# EasyEDA Pro project ProPrj_transverter-front-end_2026-04-14.epro, schematic transverter-power-board
Board Name: transverter-power-board; Create Date: 2026-04-02; Page Name: power-board; Project Name: transverter-front-end; Schematic Name: transverter-power-board; Update Date: 2026-04-13; Add into BOM: yes; Company: Your Company; Convert to PCB: yes; Date: 2026-02-19; Draw By: dbenhart; REV: 1.0; Sheet: 1/1; spicePre: .
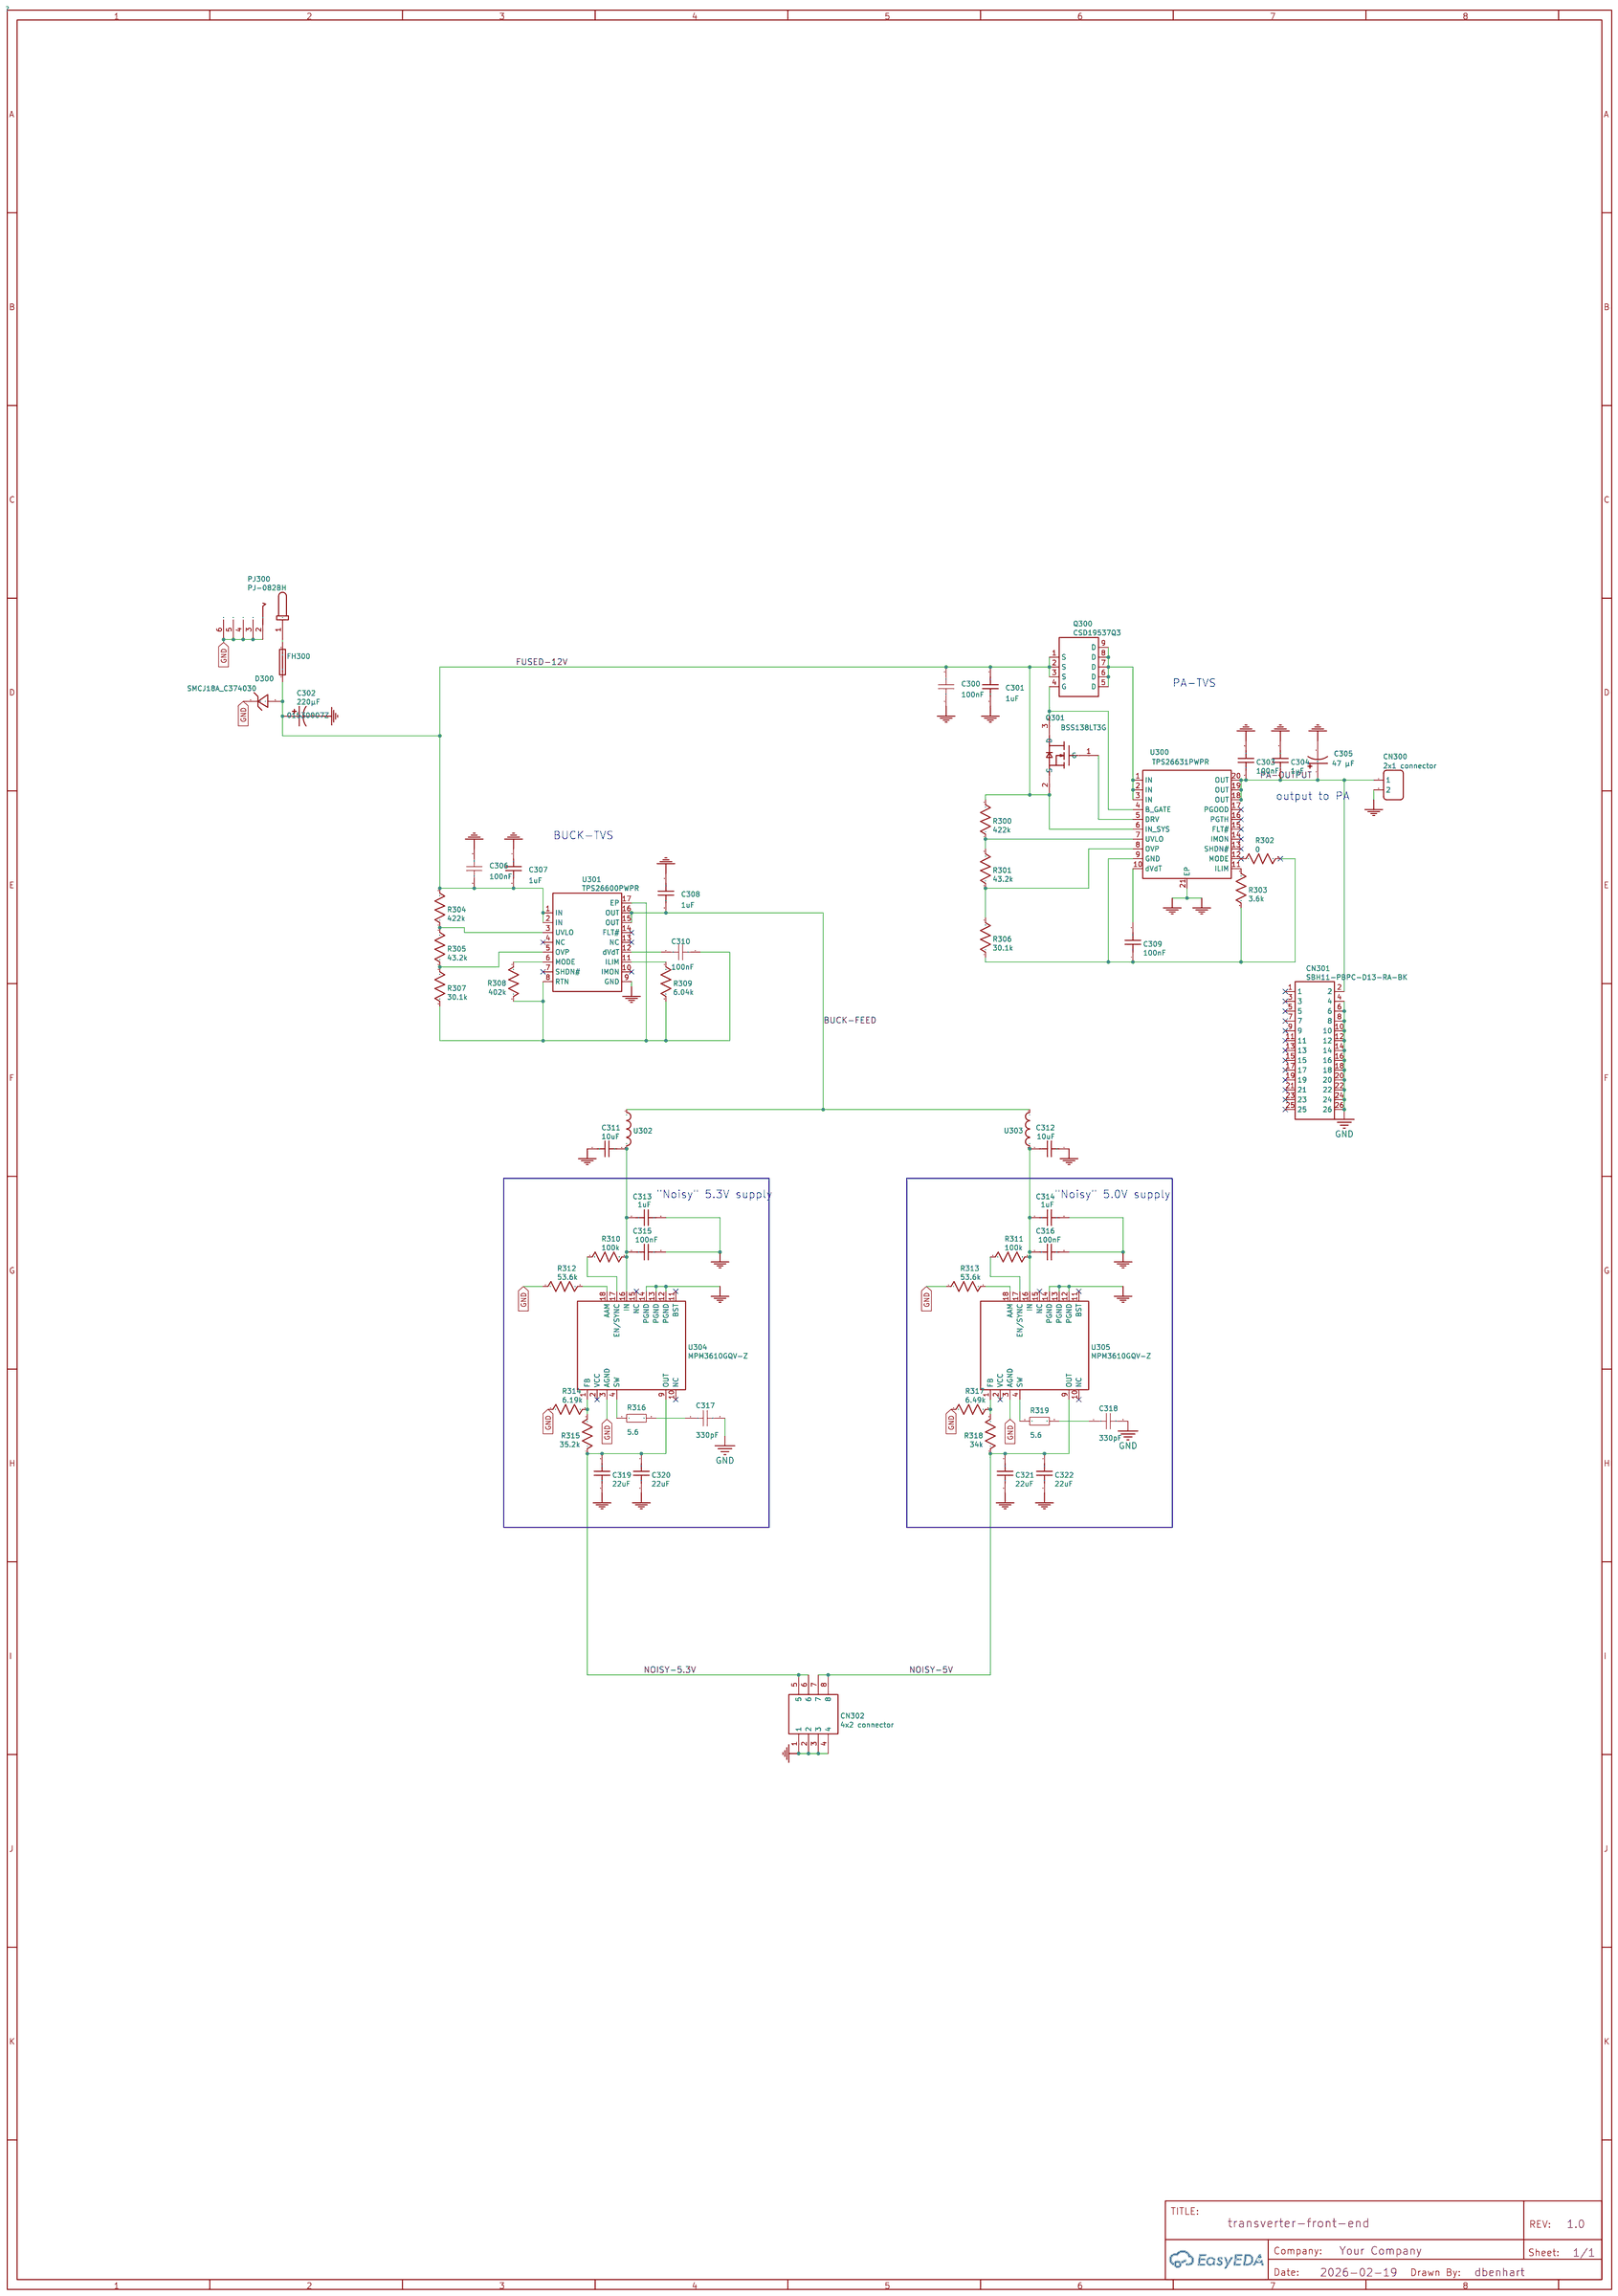
[diagram p4: schematic sheet]

## Parts
C300  100nF  [C0805]
C301  1uF  [C0805]
C302  220µF  [CAP-TH_BD10.0-P5.00-D0.6-FD]
C303  100nF  [C0805]
C304  1uF  [C0805]
C305  47 µF  [CAP-TH_BD8.0-P3.50-D0.6-FD]
C306  100nF  [C0805]
C307  1uF  [C0805]
C308  1uF  [C0805]
C309  100nF  [C0805]
C310  100nF  [C0805]
C311  10uF  [C0805]
C312  10uF  [C0805]
C313  1uF  [C0805]
C314  1uF  [C0805]
C315  100nF  [C0805]
C316  100nF  [C0805]
C317  330pF  [C0805]
C318  330pF  [C0805]
C319  22uF  [C0805]
C320  22uF  [C0805]
C321  22uF  [C0805]
C322  22uF  [C0805]
CN300  2x1 connector  [CONN-TH_2P-P3.00_MOLEX_436500200]
CN301  SBH11-PBPC-D13-RA-BK  [IDC-TH_26P-P2.54-H-M-R2-C13-W8.8]
CN302  4x2 connector  [CONN-TH_0430450800]
D300  SMCJ18A_C374030  [SMC_L6.9-W5.9-LS7.9-RD]
FH300  01530007Z  [01530007Z]
PJ300  PJ-082BH  [AUDIO-TH_PJ-082BH]
Q300  CSD19537Q3  [DFN-8_L3.3-W3.3-P0.65-BL-3]
Q301  BSS138LT3G  [SOT-23-3_L2.9-W1.3-P1.90-LS2.4-BR]
R300  422k  [R0805]
R301  43.2k  [R0805]
R302  0  [R0805]
R303  3.6k  [R0805]
R304  422k  [R0805]
R305  43.2k  [R0805]
R306  30.1k  [R0805]
R307  30.1k  [R0805]
R308  402k  [R0805]
R309  6.04k  [R0805]
R310  100k  [R0805]
R311  100k  [R0805]
R312  53.6k  [R0805]
R313  53.6k  [R0805]
R314  6.19k  [R0805]
R315  35.2k  [R0805]
R316  5.6  [R0805]
R317  6.49k  [R0805]
R318  34k  [R0805]
R319  5.6  [R0805]
U300  TPS26631PWPR  [HTSSOP-20_L6.5-W4.4-P0.65-LS6.4-BL-EP]
U301  TPS26600PWPR  [HTSSOP-16_L5.0-W4.4-P0.65-LS6.4-BL-EP2.5]
U302  BLM31PG601SH1L  [L1206]
U303  BLM31PG601SH1L  [L1206]
U304  MPM3610GQV-Z  [QFN-20_L5.0-W3.0-TL-MPM3610GQV-Z]
U305  MPM3610GQV-Z  [QFN-20_L5.0-W3.0-TL-MPM3610GQV-Z]

## Library data of the parts
C300 C306 C310 = KGM21NR71E104KT: Capacitance:100nF Tolerance:±10% Tolerance:±10% Voltage Rating:25V Temperature Coefficient:X7R; LCSC Part Name: 100nF ±10% 25V; Supplier Part: C20220997; Manufacturer: Kyocera AVX; JLCPCB Part Class: Extended Part; Supplier: LCSC; Tolerance: ±10%; Voltage Rating: 25V; Temperature Coefficient: X7R
C301 C307 C308 C313 C314 = 1uF: Supplier Part: 478-KGM21ER71E105KUCT-ND; Supplier: Digi-Key; Manufacturer Part: KGM21ER71E105KU; voltage: 25; Manufacturer: KYOCERA AVX; nameAlias: Value(F); Contributor: LCEDA_Lib; spicePre: C; spiceSymbolName: C_0603_US; Package Display: No
C302 = EEH-AZS1H221B: Supplier: LCSC; Supplier Part: C7271692; Manufacturer: PANASONIC(松下); JLCPCB Part Class: Extended Part; Contributor: lcsc; spicePre: U; spiceSymbolName: EEH-AZSE102UB
C303 C309 = 100nF: Supplier Part: C2182247; Supplier: Digi-Key; Manufacturer Part: KGM21NR71E104KT; voltage: 50; Manufacturer: KYOCERA AVX; JLCPCB Part Class: Extended Part; nameAlias: Value(F); Contributor: LCEDA_Lib; spicePre: C; spiceSymbolName: C_0603_US; Package Display: No
C304 = 1uF: Supplier Part: 478-KGM21ER71E105KUCT-ND; Supplier: Digi-Key; Manufacturer Part: KGM21ER71E105KU; voltage: 25; Manufacturer: KYOCERA AVX; JLCPCB Part Class: Extended Part; nameAlias: Value(F); Contributor: LCEDA_Lib; spicePre: C; spiceSymbolName: C_0603_US; Package Display: No
C305 = EEH-AZA1H470B: Supplier: Digi-Key; Supplier Part: 10-EEH-AZA1H470BCT-ND; Manufacturer: PANASONIC(松下); JLCPCB Part Class: Extended Part; Contributor: lcsc; spicePre: C; spiceSymbolName: EEH-AZA1H680B
C311 C312 = 10uF: Supplier Part: 490-GRM21BZ71E106KE15LCT-ND; Supplier: Digi-Key; Manufacturer Part: GRM21BZ71E106KE15L; voltage: 25; Manufacturer: Murata; nameAlias: Value(F); Contributor: LCEDA_Lib; spicePre: C; spiceSymbolName: C_0603_US; Package Display: No
C315 C316 = 100nF: Supplier Part: 478-KGM21NR71E104KTCT-ND; Supplier: Digi-Key; Manufacturer Part: KGM21NR71E104KT; voltage: 50; Manufacturer: KYOCERA AVX; nameAlias: Value(F); Contributor: LCEDA_Lib; spicePre: C; spiceSymbolName: C_0603_US; Package Display: No
C317 = CAP_0603: Supplier Footprint: 0805; Manufacturer: KYOCERA AVX; Manufacturer Part: KGM21BCG1H331JT; Capacitance: 330pf
C318 = CAP_0603: Supplier Footprint: 0805; Manufacturer: KYOCERA AVX; Manufacturer Part: KGM21BCG1H331JT
C319-C322 = 22uF: Supplier: LCSC; Supplier Part: C907991; Manufacturer: muRata(村田); Manufacturer Part: GRM21BZ71A226ME15L; JLCPCB Part Class: Extended Part; nameAlias: Value; Contributor: lcsc; spicePre: C; spiceSymbolName: GRM21BZ71A226ME15L
CN300 = MOLEX 2PIN: Manufacturer: MOLEX; Manufacturer Part: 436500200; Supplier: LCSC; Supplier Part: C192562; Contributor: Jayden Lee; spicePre: J
CN301 = SBH11-PBPC-D13-RA-BK: Supplier: LCSC; Supplier Part: C17260960; Manufacturer: Sullins; JLCPCB Part Class: Extended Part; Contributor: lcsc; spicePre: C
CN302 = 0430450800: Supplier: LCSC; Manufacturer: MOLEX; Supplier Part: C122422; JLCPCB Part Class: Extended Part; spicePre: C
D300 = SMCJ18A_C374030: Supplier: LCSC; Supplier Part: C374030; Manufacturer: Littelfuse(美国力特); Manufacturer Part: SMCJ18A; JLCPCB Part Class: Extended Part; Contributor: LCSC; spicePre: D
FH300 = 01530007Z: Supplier: LCSC; Supplier Part: C206906; Manufacturer: Littelfuse(美国力特); JLCPCB Part Class: Extended Part; Contributor: LCSC; spicePre: F
PJ300 = PJ-082BH: Supplier: LCSC; Supplier Part: C3094233; Manufacturer: CUI; JLCPCB Part Class: Extended Part; Contributor: lcsc; spicePre: P
Q300 = CSD19537Q3: Supplier: LCSC; Supplier Part: C478469; Manufacturer: TI(德州仪器); JLCPCB Part Class: Extended Part; Contributor: LCSC; spicePre: Q
Q301 = BSS138LT3G: Supplier: LCSC; Manufacturer: onsemi(安森美); Supplier Part: C83790; JLCPCB Part Class: Extended Part; Contributor: LCSC; spicePre: Q
R300 R304 = 422k: Manufacturer Part: ERA-6AEB4223V; Manufacturer: Panasonic; nameAlias: Value(Ω); Contributor: LCEDA_Lib; spicePre: R; spiceSymbolName: R_0603_US; Package Display: No
R301 R305 = 43.2k: Manufacturer Part: TNPW080543K2BEEA; Manufacturer: Vishay Dale; nameAlias: Value(Ω); Contributor: LCEDA_Lib; spicePre: R; spiceSymbolName: R_0603_US; Package Display: No
R302 = 0: Manufacturer: Vishay Dale; nameAlias: Value(Ω); Contributor: LCEDA_Lib; spicePre: R; spiceSymbolName: R_0603_US; Package Display: No
R303 = 3.6k: Manufacturer Part: TNPW08053K60BEEA; Manufacturer: Vishay Dale; nameAlias: Value(Ω); Contributor: LCEDA_Lib; spicePre: R; spiceSymbolName: R_0603_US; Package Display: No
R306 R307 = 30.1k: Manufacturer Part: TNPW080530K1BEEA; Manufacturer: Vishay Dale; nameAlias: Value(Ω); Contributor: LCEDA_Lib; spicePre: R; spiceSymbolName: R_0603_US; Package Display: No
R308 = 402k: Manufacturer Part: ERA-6AEB4023V; Manufacturer: Panasonic; nameAlias: Value(Ω); Contributor: LCEDA_Lib; spicePre: R; spiceSymbolName: R_0603_US; Package Display: No
R309 = 6.04k: Manufacturer Part: TNPW08056K04BEEA; Manufacturer: Vishay Dale; nameAlias: Value(Ω); Contributor: LCEDA_Lib; spicePre: R; spiceSymbolName: R_0603_US; Package Display: No
R310 R311 = 100k: Manufacturer Part: TNPW0805100KBYEA; Manufacturer: Vishay Dale; nameAlias: Value(Ω); Contributor: LCEDA_Lib; spicePre: R; spiceSymbolName: R_0603_US; Package Display: No
R312 R313 = 53.6k: Manufacturer Part: TNPW080553K6BEEN; Manufacturer: Vishay Dale; nameAlias: Value(Ω); Contributor: LCEDA_Lib; spicePre: R; spiceSymbolName: R_0603_US; Package Display: No
R314 = 6.19k: Manufacturer Part: TNPW08056K19BEEA; Manufacturer: Vishay Dale; nameAlias: Value(Ω); Contributor: LCEDA_Lib; spicePre: R; spiceSymbolName: R_0603_US; Package Display: No
R315 = 35.2k: Manufacturer Part: TNPW080535K2BEEN; Manufacturer: Vishay Dale; nameAlias: Value(Ω); Contributor: LCEDA_Lib; spicePre: R; spiceSymbolName: R_0603_US; Package Display: No
R316 R319 = Res_0603: Supplier Footprint: 0805; Manufacturer: TE Connectivity Passive Product; Manufacturer Part: CPF0805B5R6E1
R317 = 6.49k: Manufacturer Part: TNPW08056K49BEEA; Manufacturer: Vishay Dale; nameAlias: Value(Ω); Contributor: LCEDA_Lib; spicePre: R; spiceSymbolName: R_0603_US; Package Display: No
R318 = 34k: Manufacturer Part: TNPW080534K0BEEA; Manufacturer: Vishay Dale; nameAlias: Value(Ω); Contributor: LCEDA_Lib; spicePre: R; spiceSymbolName: R_0603_US; Package Display: No
U300 = TPS26631PWPR: Supplier: Digi-Key; Supplier Part: 296-TPS26631PWPRCT-ND; Manufacturer: TI(德州仪器); JLCPCB Part Class: Extended Part; Contributor: lcsc; spicePre: U
U301 = TPS26600PWPR: Supplier: LCSC; Supplier Part: C544399; Manufacturer: TI(德州仪器); JLCPCB Part Class: Extended Part; Contributor: LCSC; spicePre: U
U302 U303 = BLM31PG601SH1L: Supplier: LCSC; Supplier Part: C167450; Manufacturer: muRata(村田); JLCPCB Part Class: Extended Part; Contributor: LCSC; spicePre: U; Package Display: No
U304 U305 = MPM3610GQV-Z: Supplier: LCSC; Supplier Part: C5183856; Manufacturer: MPS(芯源); JLCPCB Part Class: Extended Part; Contributor: lcsc; spicePre: U

## Nets
GND: C300.1 C301.2 C302.2 C303.2 C304.2 C305.2 C306.2 C307.1 C308.1 C311.1 C312.1 C313.2 C314.2 C315.2 C316.2 C317.2 C318.2 C319.2 C320.2 C321.2 C322.2 CN300.2 CN301.4 CN301.6 CN301.8 CN301.10 CN301.12 CN301.14 CN301.16 CN301.18 CN301.20 CN301.22 CN301.24 CN301.26 CN302.1 CN302.2 CN302.3 CN302.4 D300.1(C) PJ300.2 PJ300.3 PJ300.4 PJ300.5 PJ300.6 R312.1 R313.1 R314.1 R317.1 U300.21(EP) U301.9(GND) U304.3(AGND) U304.12(PGND) U304.13(PGND) U304.14(PGND) U305.3(AGND) U305.12(PGND) U305.13(PGND) U305.14(PGND)
BUCK-FEED: C308.2 U301.15(OUT) U301.16(OUT) U302.1 U303.1
FUSED-12V: C300.2 C301.1 C302.1 C306.1 C307.2 D300.2(A) FH300.1 Q300.1(S) Q300.2(S) Q300.3(S) Q301.2(S) R300.2 R304.2 U300.6(IN_SYS) U301.1(IN) U301.2(IN)
NOISY-5.3V: C319.1 C320.1 CN302.5 CN302.6 R315.1 U304.9(OUT)
NOISY-5V: C321.1 C322.1 CN302.7 CN302.8 R318.1 U305.9(OUT)
PA-OUTPUT: C303.1 C304.1 C305.1 CN300.1 CN301.2 U300.18(OUT) U300.19(OUT) U300.20(OUT)
$C309_2: C309.2 U300.10(dVdT)
$C310_1: C310.1 R307.1 R308.2 R309.2 U301.8(RTN) U301.17(EP)
$C310_2: C310.2 U301.12(dVdT)
$C311_2: C311.2 C313.1 C315.1 R310.2 U302.2 U304.16(IN)
$C312_2: C312.2 C314.1 C316.1 R311.2 U303.2 U305.16(IN)
$C317_1: C317.1 R316.2
$C318_1: C318.1 R319.2
$FH300_2: FH300.2 PJ300.1
$Q300_4: Q300.4(G) Q301.3(D) U300.4(B_GATE)
$Q300_5: Q300.5(D) Q300.6(D) Q300.7(D) Q300.8(D) Q300.9(D) U300.1(IN) U300.2(IN) U300.3(IN)
$Q301_1: Q301.1(G) U300.5(DRV)
$R300_1: R300.1 R301.2 U300.7(UVLO)
$R301_1: R301.1 R306.2 U300.8(OVP)
$R303_1: R303.1 U300.11(ILIM)
$R304_1: R304.1 R305.2 U301.3(UVLO)
$R305_1: R305.1 R307.2 U301.5(OVP)
$R308_1: R308.1 U301.6(MODE)
$R309_1: R309.1 U301.11(ILIM)
$R310_1: R310.1 U304.17(EN/SYNC)
$R311_1: R311.1 U305.17(EN/SYNC)
$R312_2: R312.2 U304.18(AAM)
$R313_2: R313.2 U305.18(AAM)
$R314_2: R314.2 R315.2 U304.1(FB)
$R316_1: R316.1 U304.4(SW)
$R317_2: R317.2 R318.2 U305.1(FB)
$R319_1: R319.1 U305.4(SW)
Net-(C309-1): C309.1 R302.2 R303.2 R306.1 U300.9(GND)
Net-(R302-1): R302.1 U300.12(MODE)

Not connected (* = marked no-connect by the designer): CN301 1* 3* 5* 7* 9* 11* 13* 15* 17* 19* 21* 23* 25*; U300 13(SHDN#)* 14(IMON)* 15(FLT#)* 16(PGTH)* 17(PGOOD)*; U301 4(NC)* 7(SHDN#)* 10(IMON)* 13(NC)* 14(FLT#)*; U304 2(VCC)* 10(NC)* 11(BST)* 15(NC)*; U305 2(VCC)* 10(NC)* 11(BST)* 15(NC)*

## Notes on the sheet
- PA-TVS
- output to PA
- BUCK-TVS
- "Noisy" 5.3V supply
- "Noisy" 5.0V supply
